# Altium project Synchronous_Rectifier_V0.1.PrjPcb
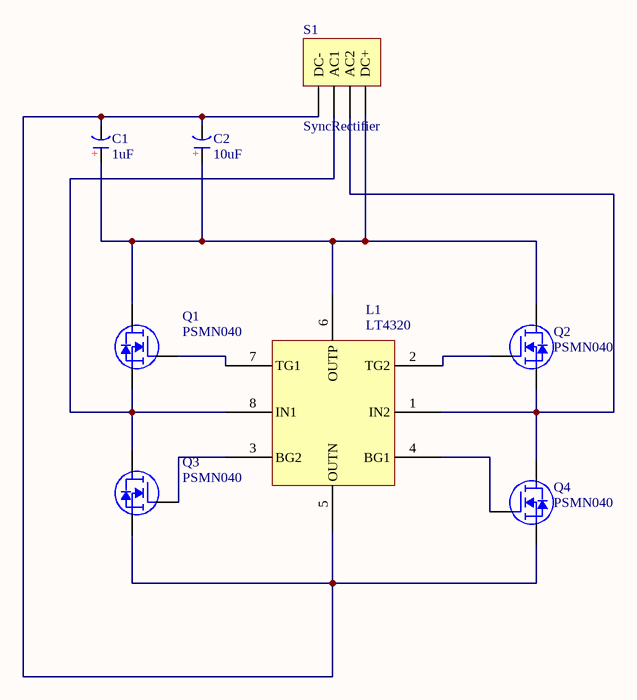
[diagram p0: Sync_Rectifier_v0.1.SchDoc]
1 sheet, 8 parts. Net scope: global (net labels, ports and power ports of the same name join across sheets).
Board file: Sync_Rectifier_v0.1.PcbDoc

## Sheet Sync_Rectifier_v0.1.SchDoc
size A4

### Parts
C1  1uF  [C 0805]
C2  10uF  [2220]
L1  LT4320  [DIP-8]
Q1  PSMN040  [SOT-1210-BL]
Q2  PSMN040  [SOT-1210-BL]
Q3  PSMN040  [SOT-1210-BL]
Q4  PSMN040  [SOT-1210-BL]
S1  SyncRectifier  [GBU]

### Nets
NetC1_1: C1.1(A) C2.1(A) L1.6(OUTP) Q1.3(D) Q2.3(D) S1.4(DC+)
NetC1_2: C1.2(K) C2.2(K) L1.5(OUTN) Q3.1(S) Q4.1(S) S1.1(DC-)
NetL1_1: L1.1(IN2) Q2.1(S) Q4.3(D) S1.3(AC2)
NetL1_2: L1.2(TG2) Q2.2(G)
NetL1_3: L1.3(BG2) Q3.2(G)
NetL1_4: L1.4(BG1) Q4.2(G)
NetL1_7: L1.7(TG1) Q1.2(G)
NetL1_8: L1.8(IN1) Q1.1(S) Q3.3(D) S1.2(AC1)

### Notes on the sheet
- (in symbol C-CD) +

### Library data of the parts
C1 C2 = C-CD: 贴片钽电容; 版权归属: 源创客; BOM名称: 贴片钽电容; 学习资源: www.ooocke.com
L1 = LT4320: Ideal Diode Bridge Controller
Q1-Q4 = PSMN040-100MSE: N-channel 100 V 36.6 mΩ standard level MOSFET
S1 = SyncRectifier: pin to pad: 1>DC- 2>AC1 3>AC2 4>DC+